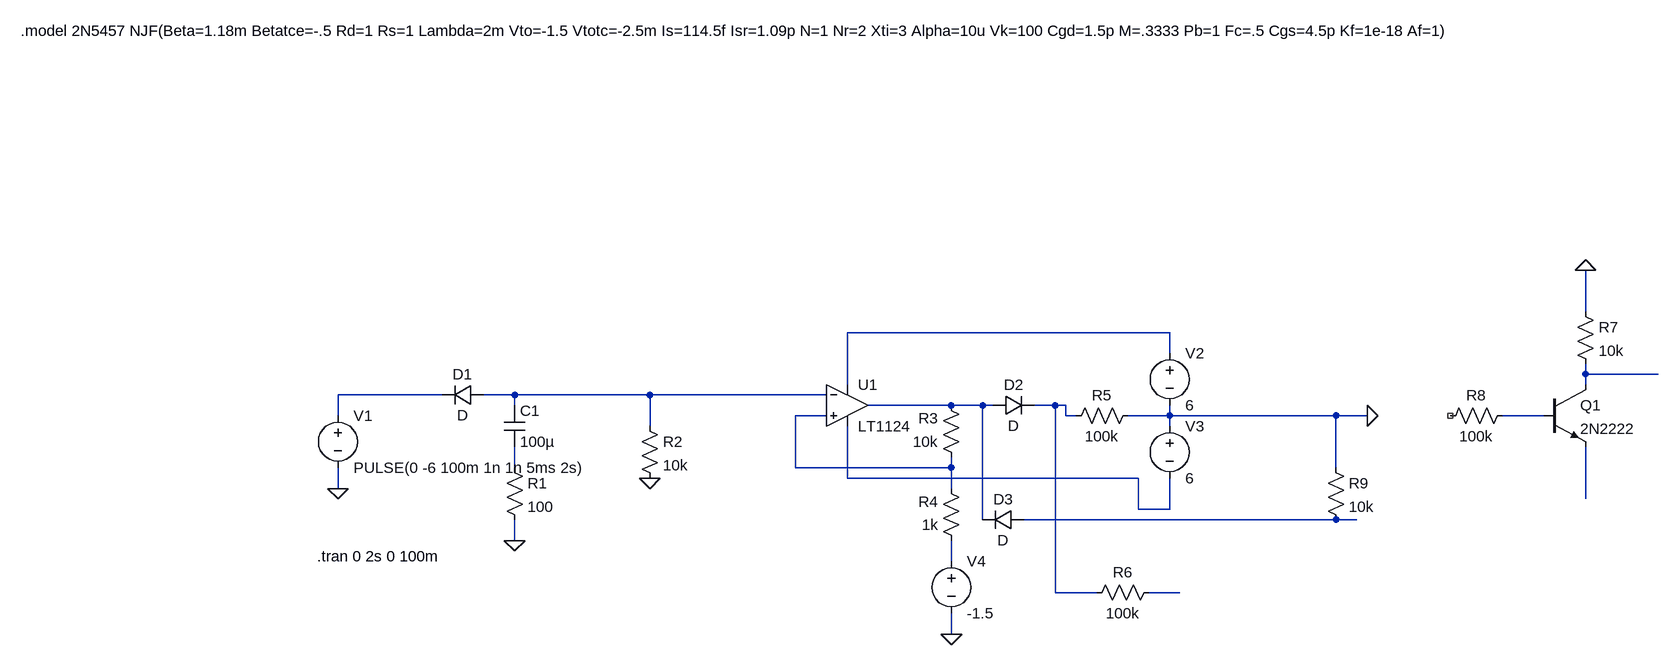
[diagram p0: schematic pulseExtender.asc]
pulseExtender.asc, the LTspice schematic file:
Version 4.1
SHEET 1 2664 628
WIRE 1888 -16 1888 -80
WIRE 1248 16 752 16
WIRE 1248 48 1248 16
WIRE 1888 80 1888 64
WIRE 2000 80 1888 80
WIRE 752 96 752 16
WIRE 1888 96 1888 80
WIRE 128 112 -32 112
WIRE 240 112 192 112
WIRE 448 112 240 112
WIRE 720 112 448 112
WIRE 240 128 240 112
WIRE 912 128 784 128
WIRE 960 128 912 128
WIRE 976 128 960 128
WIRE 1072 128 1040 128
WIRE 1088 128 1072 128
WIRE -32 144 -32 112
WIRE 720 144 672 144
WIRE 1088 144 1088 128
WIRE 1104 144 1088 144
WIRE 1248 144 1248 128
WIRE 1248 144 1184 144
WIRE 1504 144 1248 144
WIRE 1552 144 1504 144
WIRE 1824 144 1760 144
WIRE 448 160 448 112
WIRE 1248 160 1248 144
WIRE 240 224 240 192
WIRE 672 224 672 144
WIRE 912 224 912 208
WIRE 912 224 672 224
WIRE 1504 224 1504 144
WIRE 752 240 752 160
WIRE 1200 240 752 240
WIRE -32 256 -32 224
WIRE 912 256 912 224
WIRE 1888 272 1888 192
WIRE 1200 288 1200 240
WIRE 1248 288 1248 240
WIRE 1248 288 1200 288
WIRE 960 304 960 128
WIRE 1504 304 1024 304
WIRE 1536 304 1504 304
WIRE 240 336 240 304
WIRE 912 368 912 336
WIRE 1072 416 1072 128
WIRE 1136 416 1072 416
WIRE 1264 416 1216 416
WIRE 912 480 912 448
FLAG -32 256 0
FLAG 240 336 0
FLAG 1552 144 0
FLAG 448 240 0
FLAG 912 480 0
FLAG 1888 -80 0
SYMBOL diode 192 96 R90
WINDOW 0 0 32 VBottom 2
WINDOW 3 32 32 VTop 2
SYMATTR InstName D1
SYMBOL cap 224 128 R0
SYMATTR InstName C1
SYMATTR Value 100µ
SYMBOL res 224 208 R0
SYMATTR InstName R1
SYMATTR Value 100
SYMBOL voltage -32 128 R0
WINDOW 123 0 0 Left 0
WINDOW 39 0 0 Left 0
SYMATTR InstName V1
SYMATTR Value PULSE(0 -6 100m 1n 1n 5ms 2s)
SYMBOL OpAmps\\LT1124 752 64 R0
SYMATTR InstName U1
SYMBOL voltage 1248 32 R0
WINDOW 123 0 0 Left 0
WINDOW 39 0 0 Left 0
SYMATTR InstName V2
SYMATTR Value 6
SYMBOL voltage 1248 144 R0
WINDOW 123 0 0 Left 0
WINDOW 39 0 0 Left 0
SYMATTR InstName V3
SYMATTR Value 6
SYMBOL res 432 144 R0
SYMATTR InstName R2
SYMATTR Value 10k
SYMBOL res 928 224 R180
WINDOW 0 36 76 Left 2
WINDOW 3 36 40 Left 2
SYMATTR InstName R3
SYMATTR Value 10k
SYMBOL res 928 352 R180
WINDOW 0 36 76 Left 2
WINDOW 3 36 40 Left 2
SYMATTR InstName R4
SYMATTR Value 1k
SYMBOL voltage 912 352 R0
WINDOW 123 0 0 Left 0
WINDOW 39 0 0 Left 0
SYMATTR InstName V4
SYMATTR Value -1.5
SYMBOL diode 976 144 R270
WINDOW 0 32 32 VTop 2
WINDOW 3 0 32 VBottom 2
SYMATTR InstName D2
SYMBOL res 1200 128 R90
WINDOW 0 0 56 VBottom 2
WINDOW 3 32 56 VTop 2
SYMATTR InstName R5
SYMATTR Value 100k
SYMBOL npn 1824 96 R0
SYMATTR InstName Q1
SYMATTR Value 2N2222
SYMBOL res 1232 400 R90
WINDOW 0 0 56 VBottom 2
WINDOW 3 32 56 VTop 2
SYMATTR InstName R6
SYMATTR Value 100k
SYMBOL diode 1024 288 R90
WINDOW 0 0 32 VBottom 2
WINDOW 3 32 32 VTop 2
SYMATTR InstName D3
SYMBOL res 1488 208 R0
SYMATTR InstName R9
SYMATTR Value 10k
SYMBOL res 1872 -32 R0
SYMATTR InstName R7
SYMATTR Value 10k
SYMBOL res 1776 128 R90
WINDOW 0 0 56 VBottom 2
WINDOW 3 32 56 VTop 2
SYMATTR InstName R8
SYMATTR Value 100k
TEXT -64 360 Left 2 !.tran 0 2s 0 100m
TEXT -520 -448 Left 2 !.model 2N5457 NJF(Beta=1.18m Betatce=-.5 Rd=1 Rs=1 Lambda=2m Vto=-1.5 Vtotc=-2.5m Is=114.5f Isr=1.09p N=1 Nr=2 Xti=3 Alpha=10u Vk=100 Cgd=1.5p M=.3333 Pb=1 Fc=.5 Cgs=4.5p Kf=1e-18 Af=1)

The netlist it stands for:
* pulseExtender.asc
D1 N004 N003 D
C1 N004 N009 100µ
R1 N009 0 100
V1 N003 0 PULSE(0 -6 100m 1n 1n 5ms 2s)
X§U1 N007 N004 N001 N010 N005 LT1124  ; pins In+ In- V+ V- OUT
V2 N001 0 6
V3 0 N010 6
R2 N004 0 10k
R3 N007 N005 10k
R4 N013 N007 1k
V4 N013 0 -1.5
D2 N005 N006 D
R5 0 N006 100k
Q1 N002 N008 N011 0 2N2222
R6 N014 N006 100k
D3 N012 N005 D
R9 0 N012 10k
R7 0 N002 10k
R8 N008 NC_01 100k
.model D D
.lib standard.dio
.model NPN NPN
.model PNP PNP
.lib standard.bjt
.tran 0 2s 0 100m
.model 2N5457 NJF(Beta=1.18m Betatce=-.5 Rd=1 Rs=1 Lambda=2m Vto=-1.5 Vtotc=-2.5m Is=114.5f Isr=1.09p N=1 Nr=2 Xti=3 Alpha=10u Vk=100 Cgd=1.5p M=.3333 Pb=1 Fc=.5 Cgs=4.5p Kf=1e-18 Af=1)
.lib LTC.lib
.backanno
.end